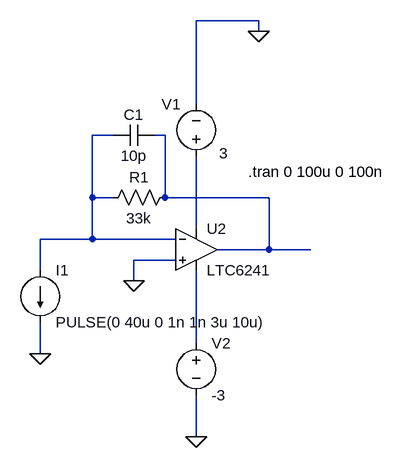
[diagram p0: schematic current_to_voltage.asc]
current_to_voltage.asc, the LTspice schematic file:
Version 4
SHEET 1 880 680
WIRE 320 -192 224 -192
WIRE 320 -176 320 -192
WIRE 224 -64 224 -192
WIRE 96 -16 64 -16
WIRE 176 -16 160 -16
WIRE 64 80 64 -16
WIRE 96 80 64 80
WIRE 176 80 176 -16
WIRE 336 80 176 80
WIRE 224 128 224 16
WIRE 64 144 64 80
WIRE 64 144 -16 144
WIRE 192 144 64 144
WIRE 336 160 336 80
WIRE 336 160 256 160
WIRE 400 160 336 160
WIRE 192 176 128 176
WIRE -16 192 -16 144
WIRE 128 208 128 176
WIRE 224 304 224 192
WIRE -16 320 -16 272
WIRE 224 448 224 384
FLAG -16 320 0
FLAG 128 208 0
FLAG 320 -176 0
FLAG 224 448 0
SYMBOL current -16 192 R0
WINDOW 123 0 0 Left 0
WINDOW 39 0 0 Left 0
SYMATTR InstName I1
SYMATTR Value PULSE(0 40u 0 1n 1n 3u 10u)
SYMBOL voltage 224 32 R180
WINDOW 0 24 96 Left 2
WINDOW 3 -49 20 Left 2
WINDOW 123 0 0 Left 0
WINDOW 39 0 0 Left 0
SYMATTR InstName V1
SYMATTR Value 3
SYMBOL voltage 224 288 R0
WINDOW 123 0 0 Left 0
WINDOW 39 0 0 Left 0
SYMATTR InstName V2
SYMATTR Value -3
SYMBOL res 192 64 R90
WINDOW 0 0 56 VBottom 2
WINDOW 3 32 56 VTop 2
SYMATTR InstName R1
SYMATTR Value 33k
SYMBOL OpAmps\\LTC6241 224 160 R0
SYMATTR InstName U2
SYMBOL cap 160 -32 R90
WINDOW 0 0 32 VBottom 2
WINDOW 3 32 32 VTop 2
SYMATTR InstName C1
SYMATTR Value 10p
TEXT 304 40 Left 2 !.tran 0 100u 0 100n

The netlist it stands for:
* current_to_voltage.asc
I1 N001 0 PULSE(0 40u 0 1n 1n 3u 10u)
V1 N003 0 3
V2 N004 0 -3
R1 N002 N001 33k
XU2 0 N001 N003 N004 N002 LTC6241  ; pins In+ In- V+ V- OUT
C1 N002 N001 10p
.tran 0 100u 0 100n
.lib LTC4.lib
.backanno
.end